# EAGLE design ispMultiplexer (EAGLE 4.16)
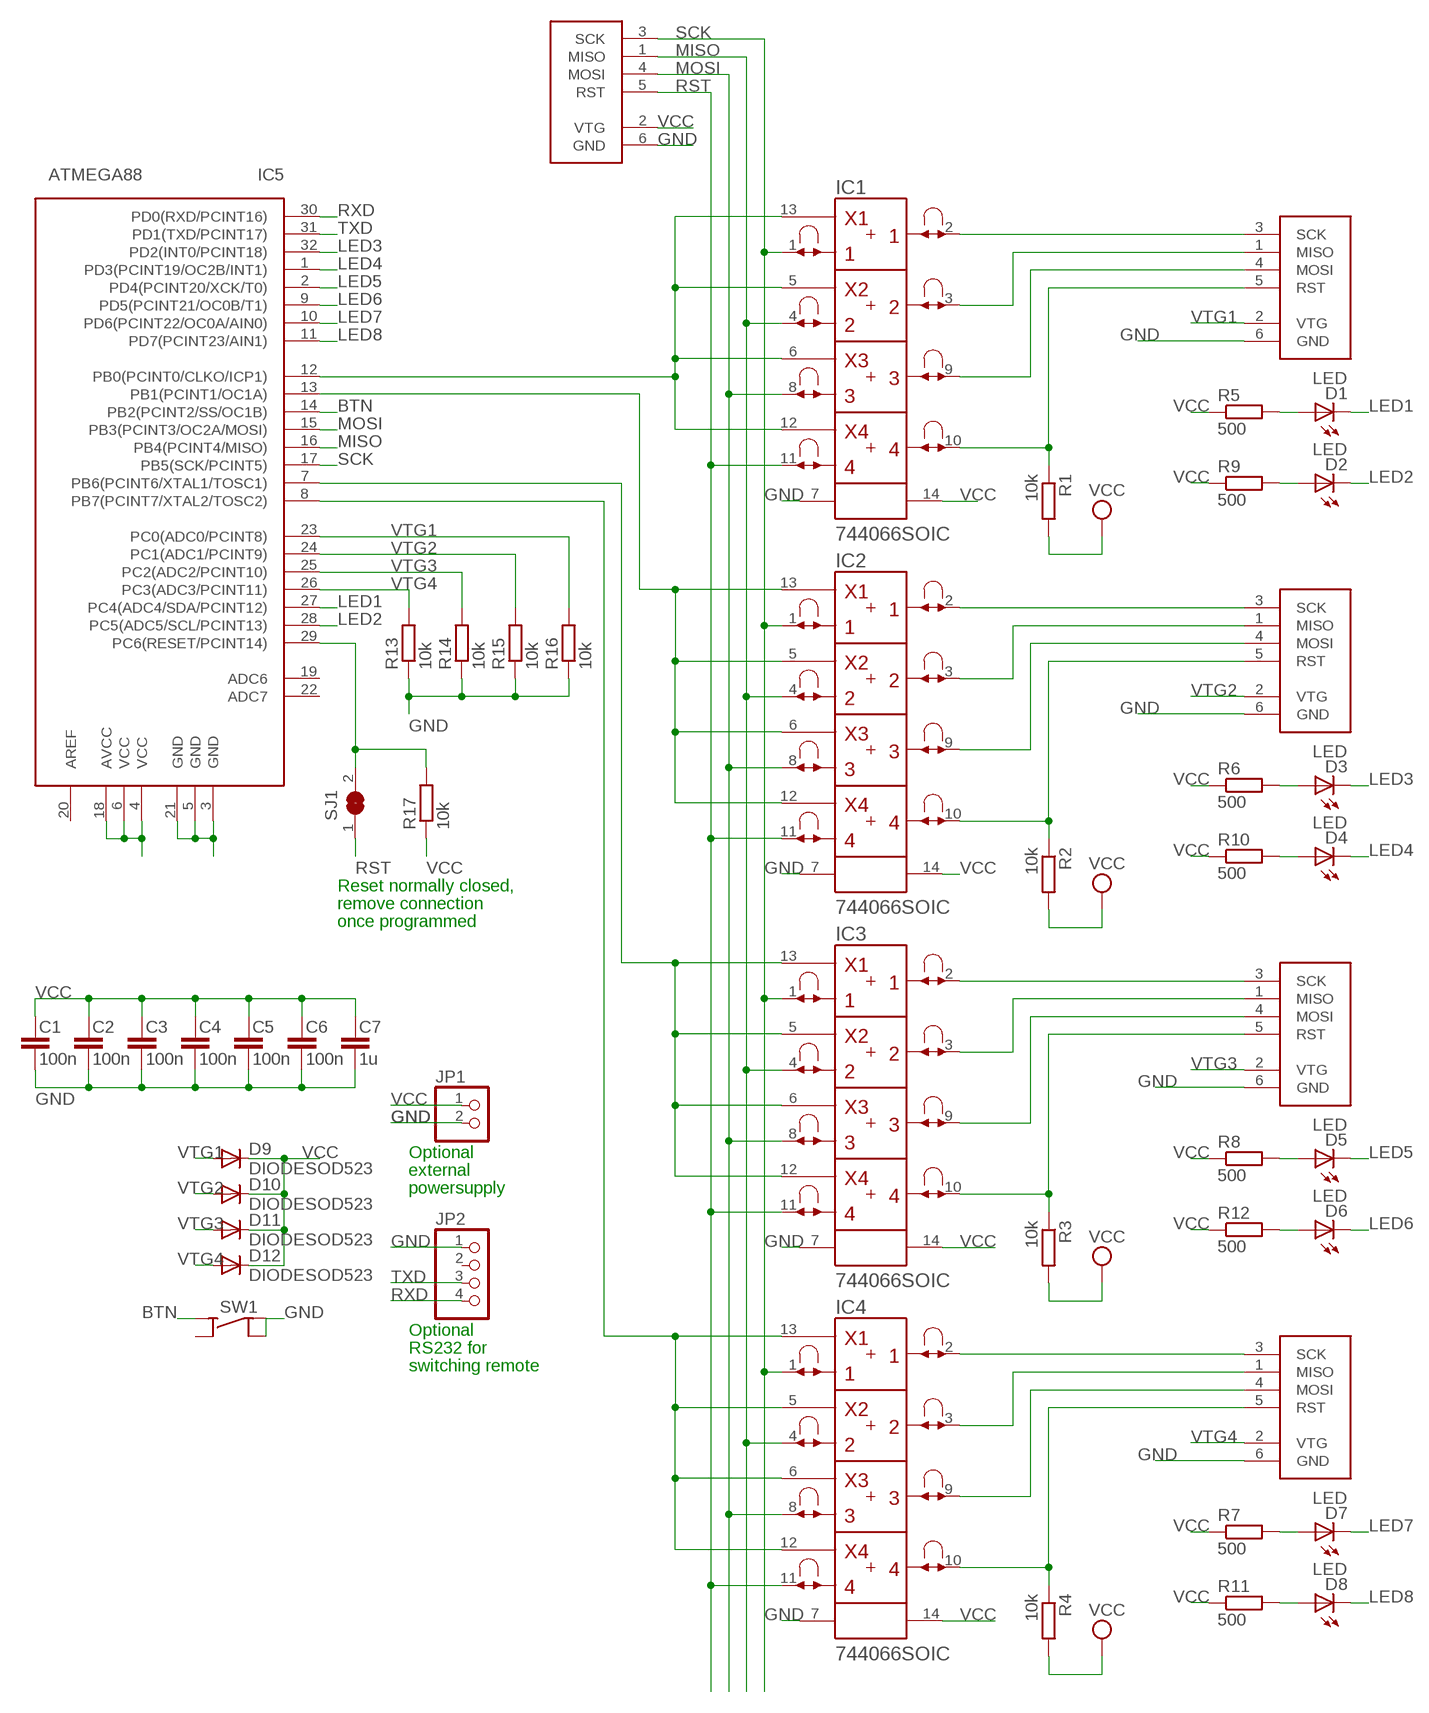
[diagram p0: schematic, sheet 1]

## Parts
C1  100n  C-EU  [C0603]
C2  100n  C-EU  [C0603]
C3  100n  C-EU  [C0603]
C4  100n  C-EU  [C0603]
C5  100n  C-EU  [C0603]
C6  100n  C-EU  [C0603]
C7  1u  C-EU  [C0603]
D1  LED  [L0603]
D2  LED  [L0603]
D3  LED  [L0603]
D4  LED  [L0603]
D5  LED  [L0603]
D6  LED  [L0603]
D7  LED  [L0603]
D8  LED  [L0603]
D9  DIODESOD523  [SOD523]
D10  DIODESOD523  [SOD523]
D11  DIODESOD523  [SOD523]
D12  DIODESOD523  [SOD523]
IC1  744066SOIC  [SO14]
IC2  744066SOIC  [SO14]
IC3  744066SOIC  [SO14]
IC4  744066SOIC  [SO14]
IC5  ATMEGA88  [TQFP32]
JP1  PINHD-1X2  [1X02]
JP2  PINHD-1X4  [1X04]
R1  10k  R-EUR0603  [R0603]
R2  10k  R-EUR0603  [R0603]
R3  10k  R-EUR0603  [R0603]
R4  10k  R-EUR0603  [R0603]
R5  500  R-EUR0603  [R0603]
R6  500  R-EUR0603  [R0603]
R7  500  R-EUR0603  [R0603]
R8  500  R-EUR0603  [R0603]
R9  500  R-EUR0603  [R0603]
R10  500  R-EUR0603  [R0603]
R11  500  R-EUR0603  [R0603]
R12  500  R-EUR0603  [R0603]
R13  10k  R-EUR0603  [R0603]
R14  10k  R-EUR0603  [R0603]
R15  10k  R-EUR0603  [R0603]
R16  10k  R-EUR0603  [R0603]
R17  10k  R-EUR0603  [R0603]
SJ1  SJ_NC  [SJ_NC]
SW1  SWITCHSMD1  [SMD1]
X1  AVRISP6PIN  [6PIN]
X2  AVRISP6PIN  [6PIN]
X3  AVRISP6PIN  [6PIN]
X4  AVRISP6PIN  [6PIN]
X5  AVRISP6PIN  [6PIN]

## Nets
BTN: IC5.14(PB2(PCINT2/SS/OC1B)) SW1.1@1
GND: C1.2 C2.2 C3.2 C4.2 C5.2 C6.2 C7.2 IC1.7(GND) IC2.7(GND) IC3.7(GND) IC4.7(GND) IC5.3(GND) IC5.5(GND) IC5.21(GND) JP1.2 JP2.1 R13.1 R14.1 R15.1 R16.1 SW1.2@0 SW1.2@1 X1.6(GND) X2.6(GND) X3.6(GND) X4.6(GND) X5.6(GND)
LED1: D1.C IC5.27(PC4(ADC4/SDA/PCINT12))
LED2: D2.C IC5.28(PC5(ADC5/SCL/PCINT13))
LED3: D3.C IC5.32(PD2(INT0/PCINT18))
LED4: D4.C IC5.1(PD3(PCINT19/OC2B/INT1))
LED5: D5.C IC5.2(PD4(PCINT20/XCK/T0))
LED6: D6.C IC5.9(PD5(PCINT21/OC0B/T1))
LED7: D7.C IC5.10(PD6(PCINT22/OC0A/AIN0))
LED8: D8.C IC5.11(PD7(PCINT23/AIN1))
MISO: IC1.4(2A) IC2.4(2A) IC3.4(2A) IC4.4(2A) IC5.16(PB4(PCINT4/MISO)) X5.1(MISO)
MOSI: IC1.8(3A) IC2.8(3A) IC3.8(3A) IC4.8(3A) IC5.15(PB3(PCINT3/OC2A/MOSI)) X5.4(MOSI)
N$1: IC1.2(1B) X1.3(SCK)
N$2: IC1.3(2B) X1.1(MISO)
N$3: IC1.9(3B) X1.4(MOSI)
N$4: IC1.10(4B) R1.1 X1.5(RST)
N$5: IC2.2(1B) X2.3(SCK)
N$6: IC2.3(2B) X2.1(MISO)
N$7: IC2.9(3B) X2.4(MOSI)
N$8: IC2.10(4B) R2.1 X2.5(RST)
N$9: IC3.2(1B) X3.3(SCK)
N$10: IC3.3(2B) X3.1(MISO)
N$11: IC3.9(3B) X3.4(MOSI)
N$12: IC3.10(4B) R3.1 X3.5(RST)
N$13: IC4.2(1B) X4.3(SCK)
N$14: IC4.3(2B) X4.1(MISO)
N$15: IC4.9(3B) X4.4(MOSI)
N$16: IC4.10(4B) R4.1 X4.5(RST)
N$17: IC5.29(PC6(RESET/PCINT14)) R17.2 SJ1.2
N$21: IC1.5(2C) IC1.6(3C) IC1.12(4C) IC1.13(1C) IC5.12(PB0(PCINT0/CLKO/ICP1))
N$22: D6.A R12.2
N$23: D1.A R5.2
N$24: D8.A R11.2
N$25: IC2.5(2C) IC2.6(3C) IC2.12(4C) IC2.13(1C) IC5.13(PB1(PCINT1/OC1A))
N$26: IC3.5(2C) IC3.6(3C) IC3.12(4C) IC3.13(1C) IC5.7(PB6(PCINT6/XTAL1/TOSC1))
N$27: IC4.5(2C) IC4.6(3C) IC4.12(4C) IC4.13(1C) IC5.8(PB7(PCINT7/XTAL2/TOSC2))
N$28: D3.A R6.2
N$30: D7.A R7.2
N$32: D5.A R8.2
N$34: D4.A R10.2
N$35: D2.A R9.2
RST: IC1.11(4A) IC2.11(4A) IC3.11(4A) IC4.11(4A) SJ1.1 X5.5(RST)
RXD: IC5.30(PD0(RXD/PCINT16)) JP2.4
SCK: IC1.1(1A) IC2.1(1A) IC3.1(1A) IC4.1(1A) IC5.17(PB5(SCK/PCINT5)) X5.3(SCK)
TXD: IC5.31(PD1(TXD/PCINT17)) JP2.3
VCC: C1.1 C2.1 C3.1 C4.1 C5.1 C6.1 C7.1 D9.C D10.C D11.C D12.C IC1.14(VCC) IC2.14(VCC) IC3.14(VCC) IC4.14(VCC) IC5.4(VCC) IC5.6(VCC) IC5.18(AVCC) JP1.1 R1.2 R2.2 R3.2 R4.2 R5.1 R6.1 R7.1 R8.1 R9.1 R10.1 R11.1 R12.1 R17.1 X5.2(VTG)
VTG1: D9.A IC5.23(PC0(ADC0/PCINT8)) R16.2 X1.2(VTG)
VTG2: D10.A IC5.24(PC1(ADC1/PCINT9)) R15.2 X2.2(VTG)
VTG3: D11.A IC5.25(PC2(ADC2/PCINT10)) R14.2 X3.2(VTG)
VTG4: D12.A IC5.26(PC3(ADC3/PCINT11)) R13.2 X4.2(VTG)
Unconnected: IC5.19(ADC6) IC5.20(AREF) IC5.22(ADC7) JP2.2 SW1.1@0

## Notes on the sheet
- Reset normally closed,
- remove connection
- once programmed
- Optional
- external
- powersupply
- Optional
- RS232 for
- switching remote

## Library data of the parts
C1-C7 = rcl:C-EU
D1-D8 = led:LED
D9-D12 = diode:DIODE: DIODE ultra fast rectifier, 3 A
IC1-IC4 = 74-4066:74*4066: Quad analog SWITCH
IC5 = atmega88:ATMEGA88
JP1 = pinhead-mm:PINHD-1X2: PIN HEADER
JP2 = pinhead-mm:PINHD-1X4
R1-R17 = rcl:R-EU
SJ1 = jumper:SJ_NC: SMD solder JUMPER
SW1 = switch:SWITCH
X1-X5 = avrisp:AVRISP6PIN

## Board
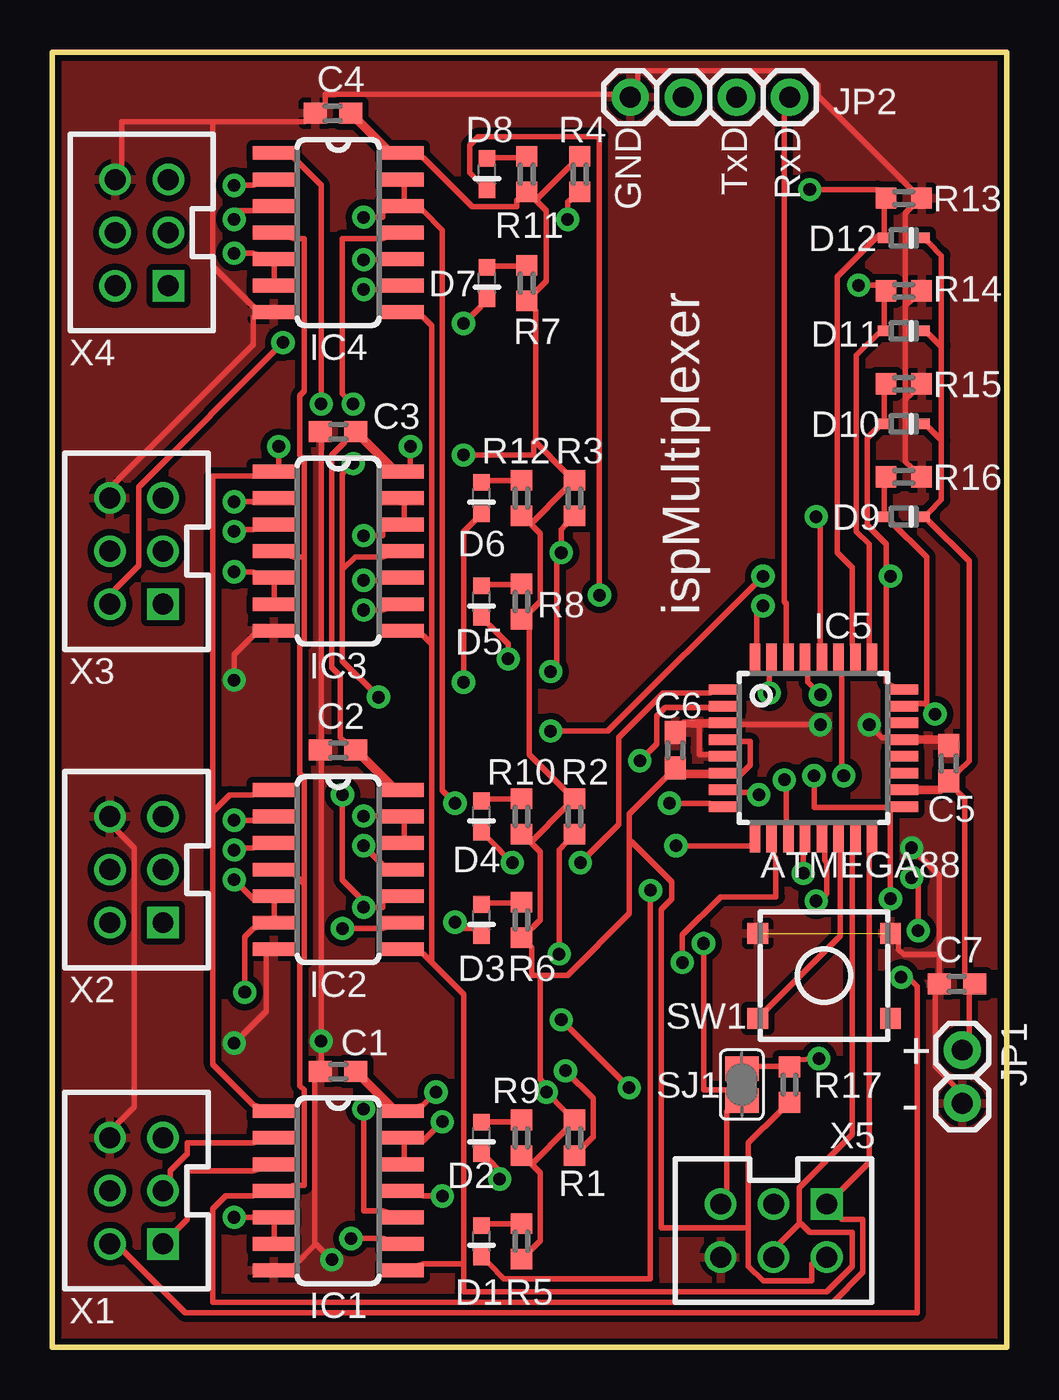
[diagram p1: board, top side]
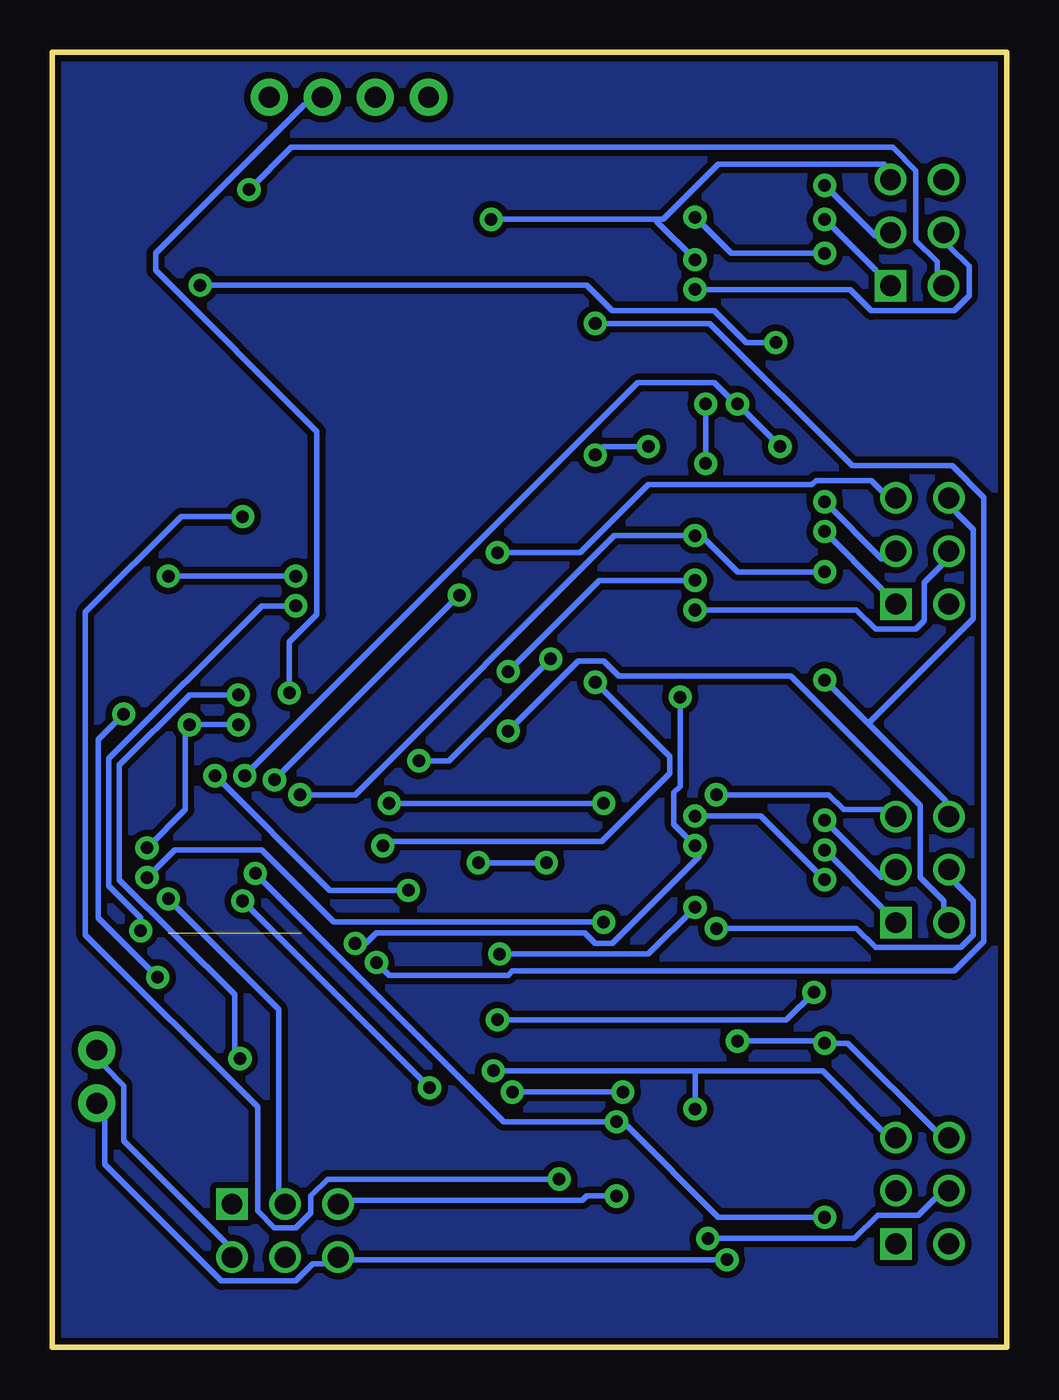
[diagram p2: board, bottom side, seen from below]

Size 45.64 x 61.97 mm. Coordinates in mm from the lower left corner, seen from the top.
Outline: 0,0 45.64,0 45.64,61.97 0,61.97 0,0
Copper layers (1*16): Top 0.035mm / dielectric 1.5mm / Bottom 0.035mm
Design rules "10mils": minimum track width 10mil, minimum drill 0.6mm, track to track 10mil, track to pad 10mil, pad to pad 10mil, via to via 10mil, smd to smd 10mil, copper to edge 10mil, drill to drill 10mil, minimum pad ring 10mil, minimum via ring 10mil, stop-mask expansion 0mil, vias tented up to drill 0mil, thermal gap 10mil

### Footprints (pad centres in the part's own frame; a part is rotated, then mirrored left to right if it is on the bottom)
C0603 = smd 1.1 x 1: 1 -0.85,0; 2 0.85,0
L0603 = smd 0.8 x 0.8: A 0,-0.75; C 0,0.75
SOD523 = smd 0.7 x 0.5: A 0.9,0; C -0.9,0
SO14 = smd 0.66 x 2.032: 1 -3.81,-3.073; 2 -2.54,-3.073; 3 -1.27,-3.073; 4 0,-3.073; 5 1.27,-3.073; 6 2.54,-3.073; 7 3.81,-3.073; 8 3.81,3.073; 9 2.54,3.073; 10 1.27,3.073; 11 0,3.073; 12 -1.27,3.073; 13 -2.54,3.073; 14 -3.81,3.073
TQFP32 = smd 1.5 x 0.5: 1 -4.25,2.65; 2 -4.25,1.85; 3 -4.25,1.05; 4 -4.25,0.25; 5 -4.25,-0.55; 6 -4.25,-1.35; 7 -4.25,-2.15; 8 -4.25,-2.95; 17 4.25,-2.95; 18 4.25,-2.15; 19 4.25,-1.35; 20 4.25,-0.55; 21 4.25,0.25; 22 4.25,1.05; 23 4.25,1.85; 24 4.25,2.65 | smd 0.5 x 1.5: 9 -2.8,-4.4; 10 -2,-4.4; 11 -1.2,-4.4; 12 -0.4,-4.4; 13 0.4,-4.4; 14 1.2,-4.4; 15 2,-4.4; 16 2.8,-4.4; 25 2.8,4.1; 26 2,4.1; 27 1.2,4.1; 28 0.4,4.1; 29 -0.4,4.1; 30 -1.2,4.1; 31 -2,4.1; 32 -2.8,4.1
1X02 = drill 1 pad 1.778 round: 1 -1.27,0; 2 1.27,0
1X04 = drill 1 pad 1.778 round: 1 -3.81,0; 2 -1.27,0; 3 1.27,0; 4 3.81,0
R0603 = smd 0.991 x 1.016: 1 -0.85,0; 2 0.85,0
SJ_NC = smd 1.168 x 1.6: 1 -0.762,0; 2 0.762,0
SMD1 = smd 1 x 1: 1@0 -3.175,2.032; 1@1 3.175,2.032; 2@0 -3.175,-2.032; 2@1 3.175,-2.032
6PIN = drill 1 square: 1 -1.27,2.54 | drill 1 round: 2 1.27,2.54; 3 -1.27,0; 4 1.27,0; 5 -1.27,-2.54; 6 1.27,-2.54

### Placement (x,y rotation side)
C1  13.68,13.2 180 top
C2  13.68,28.57 180 top
C3  13.68,43.81 180 top
C4  13.42,59.05 180 top
C5  42.89,27.93 90 top
C6  29.81,28.57 90 top
C7  43.27,17.39 180 top
D1  20.54,5.08 180 top
D2  20.54,10.03 180 top
D3  20.54,20.44 180 top
D4  20.54,25.39 180 top
D5  20.54,35.68 180 top
D6  20.54,40.64 180 top
D7  20.79,50.92 180 top
D8  20.79,56.13 180 top
D9  40.73,39.75 180 top
D10  40.73,44.19 180 top
D11  40.73,48.64 180 top
D12  40.73,53.08 180 top
IC1  13.68,7.49 270 top
IC2  13.68,22.86 270 top
IC3  13.68,38.1 270 top
IC4  13.68,53.34 270 top
IC5  36.41,28.82 0 top
JP1  43.52,12.95 270 top
JP2  31.46,59.81 0 top
R1  24.98,10.03 90 top
R2  24.98,25.39 90 top
R3  24.98,40.64 90 top
R4  25.23,56.13 90 top
R5  22.44,5.08 90 top
R6  22.44,20.44 90 top
R7  22.7,50.92 90 top
R8  22.44,35.68 90 top
R9  22.44,10.03 90 top
R10  22.44,25.39 90 top
R11  22.7,56.13 90 top
R12  22.44,40.64 90 top
R13  40.73,54.99 180 top
R14  40.73,50.54 180 top
R15  40.73,46.1 180 top
R16  40.73,41.65 180 top
R17  35.27,12.57 90 top
SJ1  32.98,12.57 90 top
SW1  36.92,17.77 180 top
X1  4.03,7.49 180 top
X2  4.03,22.86 180 top
X3  4.03,38.1 180 top
X4  4.28,53.34 180 top
X5  34.51,5.58 270 top

### Tracks (layer width: path | path; a pad name or v marks a point on that pad's centre or on a via)
BTN
  Top 0.254: IC5.14 37.66,24.38 37.68,24.38 37.68,19.68 SW1.1@1
GND  (via drill 0.6)  (1 unrouted)
  Top 0.254: IC5.5 31.46,28.37 30.95,28.37 30.95,29.84 | v36.74,29.79 32.88,29.79 IC5.3 | v39.08,29.79 39.69,29.18 39.99,29.18 IC5.21 | JP1.2 43.14,12.52 42.23,13.43 42.23,16.99 C7.2 42.43,17.8 42.43,18.79 | v41.11,23.9 42.43,22.58 42.43,18.79 | 12.56,4.9 12.56,12.72 C1.2 12.87,13.64 v12.87,14.65 12.87,28.16 C2.2 12.87,28.98 12.87,43.4 C3.2 | 12.56,4.9 11.54,3.88 IC1.7 | v13.37,4.19 12.66,4.9 12.56,4.9 | v8.7,14.55 10.22,16.07 10.22,18.82 IC2.7 | v8.7,31.92 8.7,33.14 9.61,34.06 IC3.7 | 40.8,45.33 40.8,42.39 41.11,42.08 R16.1 | 40.8,45.33 41.11,45.64 R15.1 | 40.86,49.86 40.8,49.8 40.8,45.33 | 40.86,49.86 41.11,50.11 R14.1 | 40.86,49.86 40.8,49.91 40.8,54.28 41.11,54.58 R13.1 41.11,55.39 36.64,59.86 36.64,60.37 35.93,61.08 28,61.08 28,60.68 JP2.1 26.78,59.96 13.07,59.96 13.07,59.46 C4.2 12.05,58.64 7.68,58.64 | 7.68,58.64 3.32,58.64 3.32,56.61 X4.6 | 7.68,58.64 7.68,51.73 9.61,49.8 IC4.7 9.61,49.3 9.61,47.98 3.01,41.37 X3.6 | X1.6 3.11,10.69 3.92,11.5 3.92,23.9 3.11,24.71 X2.6 | SW1.2@0 40.48,19.43 40.48,19.04 40.73,18.79 42.43,18.79
  Top 0.406: IC5.3 32.13,29.84 30.95,29.84 30.23,29.84 C6.2 | IC5.21 40.48,29.08 | IC5.21 | C5.2 42.59,29.08 IC5.21
  Bottom 0.254: v36.74,29.79 v39.08,29.79 39.28,29.28 39.28,25.72 v41.11,23.9 | JP1.2 43.14,10.89 43.14,8.76 37.55,3.17 34,3.17 33.19,3.98 32.68,3.98 X5.6 31.25,4.19 v13.37,4.19 | X1.6 3.42,10.38 7.58,14.55 v8.7,14.55 9.21,14.65 v12.87,14.65 | 6.62,29.84 2.91,26.13 X2.6 | 6.62,29.84 v8.7,31.92 | 6.62,29.84 1.59,34.87 1.59,39.14 2.4,39.95 X3.6
  pour Top (isolate 0.305): 0.22,61.72 0.22,0.25 45.43,0.25 45.43,61.72
LED1  (via drill 0.6)
  Top 0.254: v28.61,21.86 28.61,3.27 21.6,3.27 20.89,3.98 D1.C | v37.86,27.35 37.76,27.45 37.76,32.23 IC5.27
  Bottom 0.254: v28.61,21.86 32.37,21.86 v37.86,27.35
LED2  (via drill 0.6)
  Top 0.254: v21.4,8.05 21.4,8.45 20.89,8.96 D2.C | v36.54,39.75 36.74,39.54 36.74,33.65 IC5.28
  Bottom 0.254: v21.4,8.05 32.47,8.05 33.29,7.23 33.29,6.42 34,5.71 35.01,5.71 35.83,6.52 35.83,11.5 44.06,19.73 44.06,35.17 39.48,39.75 v36.54,39.75
LED3  (via drill 0.6)
  Top 0.254: v19.27,20.34 19.27,20.04 20.18,20.04 D3.C | v41.11,22.47 41.41,22.17 v41.41,19.93 | v34,35.48 33.69,35.17 33.69,33.65 IC5.32
  Bottom 0.254: v19.27,20.34 32.17,20.34 35.62,23.79 39.79,23.79 v41.11,22.47 | v41.41,19.93 41.41,20.54 42.94,22.07 42.94,28.16 35.62,35.48 v34,35.48
LED4  (via drill 0.6)
  Top 0.254: v22.01,23.18 20.89,24.3 D4.C | v25.26,23.18 27.09,25.01 27.09,29.18 29.22,31.31 31.46,31.31 IC5.1
  Bottom 0.254: v22.01,23.18 v25.26,23.18
LED5  (via drill 0.6)
  Top 0.254: v21.81,32.94 21.81,33.65 20.89,34.56 D5.C | v28.11,28.06 28.92,28.88 28.92,30.2 29.32,30.6 31.46,30.6 IC5.2
  Bottom 0.254: v21.81,32.94 26.68,28.06 v28.11,28.06
LED6  (via drill 0.6)
  Top 0.254: v19.67,31.82 19.67,39.04 20.18,39.54 D6.C | v29.83,24 33.39,24 IC5.9
  Bottom 0.254: v19.67,31.82 16.12,28.27 16.12,27.45 19.37,24.2 29.63,24.2 v29.83,24
LED7  (via drill 0.6)
  Top 0.254: v19.67,48.99 20.48,49.8 D7.C | v30.14,18.41 30.14,19.73 31.97,21.56 34.61,21.56 34.61,23.39 34.51,23.49 34.51,23.69 IC5.10
  Bottom 0.254: v19.67,48.99 14.19,48.99 7.38,42.18 2.6,42.18 1.08,40.66 1.08,19.43 2.5,18 23.63,18 23.84,17.8 29.53,17.8 v30.14,18.41
LED8  (via drill 0.6)
  Top 0.254: v26.17,35.99 26.17,57.93 20.38,57.93 19.98,57.53 19.98,56.21 20.48,55.7 D8.C | v35.01,27.15 35.12,27.05 35.12,25.12 IC5.11
  Bottom 0.254: v35.01,27.15 v26.17,35.99
MISO
  Top 0.254: IC5.16 39.08,23.69 39.08,8.86 37.76,7.54 X5.1 37.76,6.12 38.77,6.12 38.77,3.58 37.35,2.15 7.68,2.15 7.68,6.62 8.29,7.23 9.61,7.23 IC1.4 11.54,7.74 12.05,7.74 12.05,12.31 11.85,12.52 11.85,18.31 12.05,18.51 12.05,22.17 | 12.05,22.17 11.54,22.68 IC2.4 | 12.05,37.82 11.54,37.82 IC3.4 | 12.05,37.82 12.05,33.75 11.85,33.55 11.85,27.45 12.05,27.25 12.05,22.17 | IC4.4 11.54,53.06 12.05,53.06 12.05,45.74 11.85,45.54 11.85,42.69 12.05,42.49 12.05,37.82
MOSI
  Top 0.254: 35.73,5.91 35.73,7.64 38.27,10.18 38.27,23.69 IC5.15 | 35.73,5.91 34.81,5 X5.4 | 19.67,3.98 17.74,3.98 IC1.8 | 19.67,3.98 19.67,16.89 18.1,18.46 | 18.1,18.46 17.74,18.82 IC2.8 | 18.1,33.7 18.15,33.65 18.15,18.51 18.1,18.46 | 18.1,33.7 17.74,34.06 IC3.8 | IC4.8 17.74,49.3 18.15,48.89 18.15,33.75 18.1,33.7 | 35.73,5.91 35.83,5.91 36.23,5.51 38.27,5.51 38.27,3.88 37.05,2.66 19.67,2.66 19.67,3.98
N$1
  Top 0.254: IC1.2 9.61,9.77 6.46,9.77 6.46,9.27 5.65,8.45 5.65,8.15 X1.3
N$2
  Top 0.254: IC1.3 9.61,8.45 6.46,8.45 6.46,6.12 X1.1
N$3  (via drill 0.6)
  Top 0.254: v14.29,5.2 15.81,5.2 IC1.9
  Bottom 0.254: v14.29,5.2 7.28,5.2 6.16,6.32 4.23,6.32 3.42,7.13 X1.4
N$4  (via drill 0.6)
  Top 0.254: v24.55,13.23 25.87,11.91 25.87,10.08 25.46,9.67 R1.1 | v14.9,11.4 14.9,6.52 15.81,6.52 IC1.10
  Bottom 0.254: 14.9,13.23 8.8,13.23 5.96,10.38 X1.5 | 14.9,13.23 v24.55,13.23 | 14.9,13.23 v14.9,11.4
N$5  (via drill 0.6)
  Top 0.254: v8.7,25.22 9.61,25.22 IC2.2
  Bottom 0.254: v8.7,25.22 5.96,22.47 X2.3
N$6  (via drill 0.6)
  Top 0.254: v8.7,23.79 8.7,23.9 9.61,23.9 IC2.3
  Bottom 0.254: v8.7,23.79 5.96,21.05 X2.1
N$7  (via drill 0.6)
  Top 0.254: v13.88,20.04 15.81,20.04 IC2.9
  Bottom 0.254: v13.88,20.04 7.18,20.04 6.26,19.12 2.2,19.12 1.59,19.73 1.59,21.36 2.4,22.17 X2.4
N$8  (via drill 0.6)
  Top 0.254: v24.24,18.82 24.24,23.79 24.55,24.1 R2.1 | IC2.10 15.81,21.36 15.81,21.05 v14.9,21.05 14.69,21.56 13.88,22.37 v13.88,26.44
  Bottom 0.254: v24.24,18.82 17.13,18.82 v14.9,21.05 | v13.88,26.44 8.5,26.44 7.79,25.72 5.96,25.72 X2.5
N$9  (via drill 0.6)
  Top 0.254: v8.7,40.46 9.61,40.46 IC3.2
  Bottom 0.254: v8.7,40.46 5.96,37.71 X3.3
N$10  (via drill 0.6)
  Top 0.254: v8.7,39.04 8.7,39.14 9.61,39.14 IC3.3
  Bottom 0.254: v8.7,39.04 5.96,36.29 X3.1
N$11  (via drill 0.6)
  Top 0.254: v14.9,35.28 15.81,35.28 IC3.9
  Bottom 0.254: v14.9,35.28 7.18,35.28 6.26,34.36 4.33,34.36 3.92,34.77 3.92,36.6 3.11,37.41 X3.4
N$12  (via drill 0.6)
  Top 0.254: R3.1 24.55,39.34 24.35,39.14 v24.35,38.02 24.14,37.51 24.14,32.63 v23.84,32.33 | v14.9,36.7 15.81,36.7 IC3.10
  Bottom 0.254: v24.35,38.02 20.38,38.02 17.13,41.27 9.31,41.27 9.11,41.47 6.46,41.47 5.96,40.97 X3.5 | v14.9,36.7 19.47,36.7 v23.84,32.33
N$13  (via drill 0.6)
  Top 0.254: v8.7,55.6 9.61,55.6 IC4.2
  Bottom 0.254: v8.7,55.6 6.26,53.16 X4.3
N$14  (via drill 0.6)
  Top 0.254: v8.7,53.97 8.7,54.38 9.61,54.38 IC4.3
  Bottom 0.254: v8.7,53.97 6.26,51.53 X4.1
N$15  (via drill 0.6)
  Top 0.254: v14.9,50.62 15.81,50.62 IC4.9
  Bottom 0.254: v14.9,50.62 7.48,50.62 6.46,49.6 2.5,49.6 1.79,50.31 1.79,51.73 2.71,52.65 X4.4
N$16  (via drill 0.6)
  Top 0.254: v24.65,53.97 24.65,54.78 24.75,54.88 R4.1 | v14.9,52.04 15.81,52.04 IC4.10
  Bottom 0.254: 16.73,53.97 16.42,53.97 13.78,56.61 5.85,56.61 X4.5 | 16.73,53.97 v24.65,53.97 | v14.9,52.04 16.73,53.87 16.73,53.97
N$17  (via drill 0.6)
  Top 0.254: SJ1.2 33.69,13.43 34.81,13.43 R17.2 35.73,13.76 v36.66,13.81 | v36.74,31.21 36.13,31.82 36.13,32.23 IC5.29
  Bottom 0.254: v36.74,31.21 39.08,31.21 42.43,27.86 42.43,22.37 36.92,16.89 36.92,14.07 v36.66,13.81
N$18
  pour Bottom (isolate 0.305): 0.22,61.72 0.22,0.25 45.43,0.25 45.43,61.72
N$21  (via drill 0.6)
  Top 0.254: IC1.6 10.63,5.2 10.63,5.91 IC1.5 v8.7,6.22 | v35.93,22.68 35.93,23.69 IC5.12 | v18.66,10.79 17.74,9.88 IC1.13 16.83,9.77 16.83,9.06 IC1.12
  Bottom 0.254: v35.93,22.68 24.04,10.79 v18.66,10.79 18.15,10.59 13.78,6.22 v8.7,6.22
N$22
  Top 0.254: D6.A 20.89,41.47 22.01,41.47 R12.2
N$23
  Top 0.254: D1.A 20.89,5.91 22.01,5.91 R5.2
N$24
  Top 0.254: D8.A 21.09,56.92 22.21,56.92 R11.2
N$25  (via drill 0.6)
  Top 0.254: IC2.12 16.83,24.4 16.83,25.12 IC2.13 15.81,25.42 v14.9,25.42 | v36.54,21.36 36.69,21.36 37.05,21.71 37.05,23.18 36.94,23.29 36.94,23.69 IC5.13 | v24.35,15.67 v27.6,12.42 | v9.21,16.99 9.21,19.63 9.61,20.04 IC2.6 10.63,20.54 10.63,21.36 IC2.5 9.61,21.46 v8.7,22.37
  Bottom 0.254: v27.6,12.42 v36.54,21.36 | v24.35,15.67 10.53,15.67 v9.21,16.99 | v14.9,25.42 11.75,25.42 v8.7,22.37
N$26  (via drill 0.6)
  Top 0.254: IC3.6 10.63,35.78 10.63,36.6 IC3.5 9.61,37.1 v8.7,37.1 | v33.8,26.44 33.8,26.54 32.88,26.54 IC5.7 | v14.9,38.83 15.81,38.83 15.81,39.14 IC3.12 16.83,39.64 16.83,40.36 IC3.13
  Bottom 0.254: v33.8,26.44 31.15,26.44 18.76,38.83 v14.9,38.83 14.39,38.63 12.87,37.1 v8.7,37.1
N$27  (via drill 0.6)
  Top 0.254: IC4.6 10.63,51.02 10.63,51.84 IC4.5 9.61,52.34 v8.7,52.34 | v29.53,26.03 31.46,26.03 IC5.8 | v19.27,26.03 18.66,26.64 18.66,53.46 17.74,54.38 IC4.12 | IC4.13 16.83,55.6 16.83,54.88 IC4.12 | v14.9,54.07 15.81,54.07 15.81,54.38 IC4.12
  Bottom 0.254: v19.27,26.03 v29.53,26.03 | v8.7,52.34 13.17,52.34 v14.9,54.07
N$28
  Top 0.254: D3.A 20.89,21.25 22.01,21.25 R6.2
N$30
  Top 0.254: D7.A 21.09,51.73 22.21,51.73 R7.2
N$32
  Top 0.254: D5.A 20.89,36.5 22.01,36.5 R8.2
N$34
  Top 0.254: D4.A 20.89,26.23 22.01,26.23 R10.2
N$35
  Top 0.254: D2.A 20.89,10.79 22.01,10.79 R9.2
RST  (via drill 0.6)
  Top 0.254: X5.5 32.27,7.54 32.27,11.3 SJ1.1 32.27,12.31 31.15,12.31 v31.15,19.32 | v18.66,7.23 17.74,7.23 IC1.11 | v14.9,24 15.81,23.08 IC2.11 | v15.61,31.11 13.88,32.84 13.88,37.21 | 13.88,37.21 14.49,37.82 15.81,37.82 IC3.11 | v14.39,45.13 13.88,45.64 13.88,53.06 15.81,53.06 IC4.11 | v14.39,42.29 13.88,41.78 13.88,37.21
  Bottom 0.254: v18.66,7.23 20.08,7.23 20.28,7.03 31.25,7.03 X5.5 | v15.61,31.11 15.61,26.84 15.91,26.54 15.91,25.01 v14.9,24 14.69,23.49 18.86,19.32 19.67,19.32 20.18,19.83 30.14,19.83 30.64,19.32 v31.15,19.32 | v14.39,42.29 v14.39,45.13
RXD
  Top 0.254: IC5.30 35.12,33.65 35.12,35.58 35.01,35.68 35.01,58.95 JP2.4
SCK  (via drill 0.6)
  Top 0.254: v40.09,21.46 40.09,25.72 IC5.17 39.99,25.83 36.44,25.83 v36.44,27.35 | 7.68,25.62 7.68,13.53 9.61,11.6 IC1.1 | 7.68,25.62 8.5,26.44 9.61,26.44 IC2.1 | 7.68,25.62 7.68,41.68 9.61,41.68 IC3.1 10.83,42.18 v10.83,43.1 | v12.87,45.13 12.87,55.6 11.54,56.92 IC4.1
  Bottom 0.254: v40.09,21.46 34.81,16.18 34.81,7.54 X5.3 | v10.83,43.1 v12.87,45.13 13.27,45.44 13.98,46.15 17.64,46.15 v36.44,27.35
TXD  (via drill 0.6)
  Top 0.254: v34.3,31.31 34.3,32.23 IC5.31
  Bottom 0.254: v34.3,31.31 34.3,33.75 32.98,35.07 32.98,43.81 40.7,51.53 40.7,52.34 33.59,59.46 JP2.3
VCC  (via drill 0.6)
  Top 0.254: 33.29,5.71 33.29,3.88 34,3.17 36.34,3.17 36.34,3.98 X5.2 | 33.29,5.71 33.29,9.77 34.81,11.3 R17.1 | 42.53,43.4 42.53,40.56 41.92,39.95 D9.C 41.92,39.54 43.85,37.61 43.85,28.06 43.34,27.55 C5.1 43.34,26.54 43.65,26.23 43.65,17.8 C7.1 43.85,16.99 43.85,15.06 JP1.1 | 42.53,43.4 41.92,44.01 D10.C | 42.48,47.93 42.53,47.87 42.53,43.4 | 42.48,47.93 41.92,48.48 D11.C | D12.C 41.92,52.85 42.53,52.24 42.53,47.98 42.48,47.93 | C2.1 13.98,28.98 13.78,29.18 13.78,32.13 13.37,32.53 13.37,42.69 13.98,43.3 13.98,43.4 C3.1 | 23.18,54.83 23.13,54.88 R11.1 22.21,54.88 22.21,54.58 20.08,54.58 17.74,56.92 IC4.14 | 23.18,54.83 23.63,54.38 23.63,51.02 23.13,50.52 R7.1 23.13,49.6 23.13,43.3 | R4.2 24.75,56.51 23.23,54.99 23.23,54.88 23.18,54.83 | 23.13,43.3 24.55,41.88 R3.2 24.55,41.07 22.92,39.44 R12.1 22.92,39.34 23.33,38.93 23.33,35.68 22.92,35.28 R8.1 22.82,34.36 22.82,28.37 24.55,26.64 R2.2 24.55,25.83 22.92,24.2 R10.1 22.92,24.1 23.33,23.69 23.33,20.44 22.92,20.04 R6.1 22.92,19.12 22.92,17.8 23.33,17.8 | v17.13,43.1 17.13,42.18 IC3.14 | v19.67,42.69 23.02,42.69 23.02,43.3 23.13,43.3 | 22.97,8.71 22.92,8.76 R9.1 | 22.97,8.71 23.33,8.35 23.33,5.1 22.92,4.69 R5.1 | 22.97,8.71 23.02,8.76 23.02,8.86 24.55,10.38 R1.2 24.55,11.3 v23.63,12.21 23.43,12.72 23.33,12.82 23.33,17.8 | v18.35,12.21 17.74,11.6 IC1.14 | IC5.4 32.88,28.98 33.39,28.98 33.39,27.86 32.88,27.35 IC5.6 | 27.6,24.2 27.6,20.75 24.65,17.8 23.33,17.8 | 27.6,24.2 27.6,25.52 29.32,27.25 C6.1 | 33.29,5.71 29.12,5.71 29.12,20.95 29.63,21.46 29.63,22.27 27.7,24.2 27.6,24.2
  Top 0.406: IC5.6 32.11,27.43 30.1,27.43 C6.1 | IC5.18 42.47,26.66 C5.1 | C3.1 16.43,41.91 IC3.14 | C4.1 16.18,57.15 IC4.14 | 16.85,26.66 IC2.14 16.43,26.66 C2.1 | C1.1 16.43,11.3 IC1.14
  Bottom 0.254: X5.2 37.35,5 42.23,9.88 42.23,12.52 43.14,13.43 JP1.1 | v17.13,43.1 19.27,43.1 v19.67,42.69 | v23.63,12.21 v18.35,12.21
VTG1  (via drill 0.6)
  Top 0.254: R16.2 39.79,41.17 39.79,39.95 D9.A 40.09,39.54 41.82,37.82 41.82,30.8 | 41.82,30.8 41.31,30.8 IC5.23 | v40.6,17.7 40.8,17.83 41.36,17.27 41.36,1.65 6.36,1.65 3.42,4.59 X1.2 | v42.23,30.3 41.82,30.7 41.82,30.8
  Bottom 0.254: v40.6,17.7 43.45,20.54 43.45,29.08 v42.23,30.3
VTG2  (via drill 0.6)
  Top 0.254: R15.2 39.79,45.64 39.79,44.42 D10.A 39.48,44.01 38.98,43.51 38.98,39.34 39.89,38.43 39.89,36.9 | 39.89,36.9 39.89,31.82 39.99,31.72 IC5.24 | v23.84,29.48 26.58,29.48 v34,36.9 | v40.09,36.9 39.89,36.9
  Bottom 0.254: v23.84,29.48 20.48,32.84 19.27,32.84 18.55,32.13 10.33,32.13 4.13,25.93 4.13,22.47 3.01,21.36 3.01,21.05 X2.2 | v34,36.9 v40.09,36.9
VTG3  (via drill 0.6)
  Top 0.254: IC5.25 39.08,33.65 39.08,38.43 38.47,39.04 38.47,47.47 39.48,48.48 D11.A 39.79,48.79 39.79,50.11 R14.2 39.48,50.82 v38.57,50.82 | v11.04,48.08 4.13,41.17 4.13,37.41 3.01,36.29 X3.2
  Bottom 0.254: v11.04,48.08 12.46,48.08 13.98,49.6 18.86,49.6 20.08,50.82 v38.57,50.82
VTG4  (via drill 0.6)
  Top 0.254: IC5.26 38.27,33.65 38.27,37.31 37.55,38.02 37.55,51.23 39.48,53.16 D12.A 39.79,53.26 39.79,54.58 R13.2 39.48,55.39 v36.23,55.39
  Bottom 0.254: v36.23,55.39 34.2,57.42 5.45,57.42 4.33,56.31 4.33,52.95 3.32,51.94 3.32,51.53 X4.2

### Text on the board
tPlace: GND | TxD | RxD | ispMultiplexer | + | -